# Altium schematic sheet fan.SchDoc
size A4
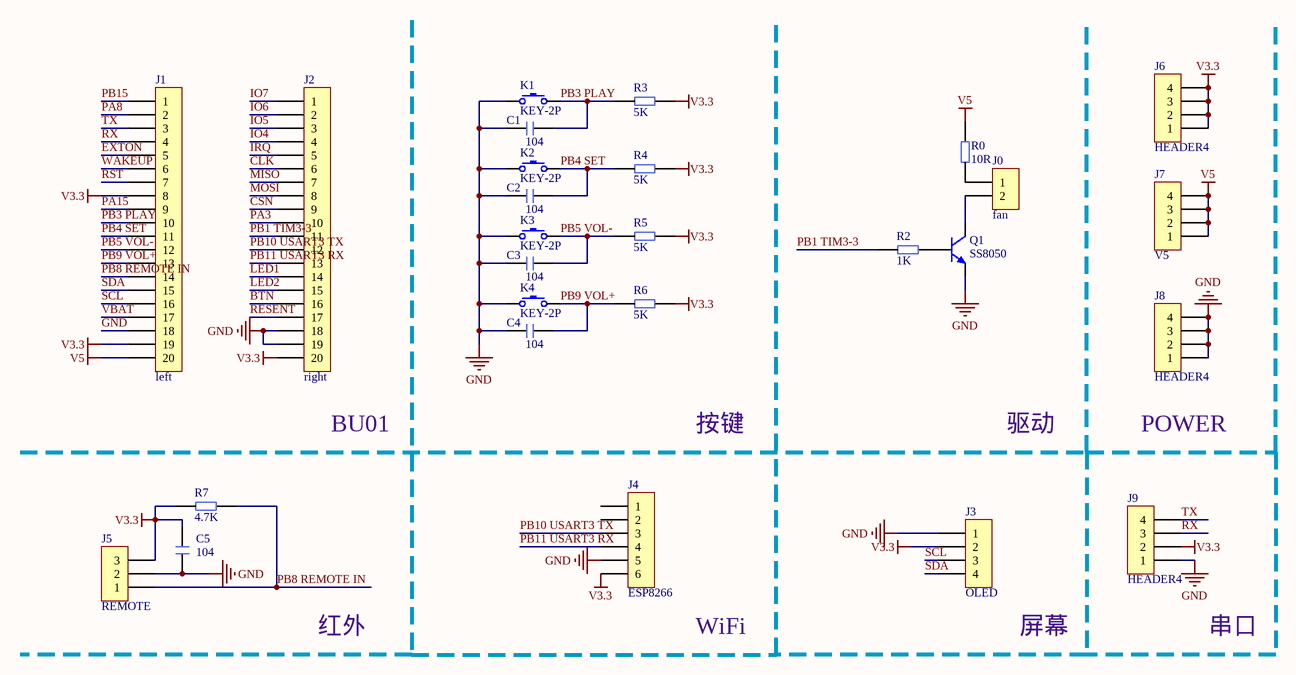
[diagram p0: fan.SchDoc]

## Parts
C1  104  [C-RAD254]
C2  104  [C-RAD254]
C3  104  [C-RAD254]
C4  104  [C-RAD254]
C5  104  [C-RAD254]
J0  fan  [PIN-2-2.54-1.0]
J1  left  [PIN-20-2.54-1.0]
J2  right  [PIN-20-2.54-1.0]
J3  OLED  [PIN-4-2.54-1.0]
J4  ESP8266  [SIP6]
J5  REMOTE  [SIP3]
J6  HEADER4  [SIP4]
J7  V5  [SIP4]
J8  HEADER4  [SIP4]
J9  HEADER4  [SIP4]
K1  KEY-2P  [KEY_M]
K2  KEY-2P  [KEY_M]
K3  KEY-2P  [KEY_M]
K4  KEY-2P  [KEY_M]
Q1  SS8050  [TO-92]
R0  10R  [R-AXIAL-0.4]
R2  1K  [R-AXIAL-0.4]
R3  5K  [R-AXIAL-0.4]
R4  5K  [R-AXIAL-0.4]
R5  5K  [R-AXIAL-0.4]
R6  5K  [R-AXIAL-0.4]
R7  4.7K  [R-AXIAL-0.4]

## Nets
GND: C1.1 C2.1 C3.1 C4.1 C5.1 J1.18 J2.18 J2.19 J3.1 J4.5 J5.2 J8.1 J8.2 J8.3 J8.4 J9.1 K1.1 K2.1 K3.1 K4.1 Q1.2(E)
V3.3: C5.2 J1.8 J1.19 J2.20 J3.2 J4.6 J5.3 J6.1 J6.2 J6.3 J6.4 J9.2 R3.1 R4.1 R5.1 R6.1 R7.2
V5: J1.20 J7.1 J7.2 J7.3 J7.4 R0.1
BTN: J2.16
CLK: J2.6
CSN: J2.9
EXTON: J1.5
IO4: J2.4
IO5: J2.3
IO6: J2.2
IO7: J2.1
IRQ: J2.5
LED1: J2.14
LED2: J2.15
MISO: J2.7
MOSI: J2.8
PA3: J2.10
PA8: J1.2
PA15: J1.9
PB1 TIM3-3: J2.11 R2.2
PB3 PLAY: C1.2 J1.10 K1.2 R3.2
PB4 SET: C2.2 J1.11 K2.2 R4.2
PB5 VOL-: C3.2 J1.12 K3.2 R5.2
PB8 REMOTE IN: J1.14 J5.1 R7.1
PB9 VOL+: C4.2 J1.13 K4.2 R6.2
PB10 USART3 TX: J2.12 J4.3
PB11 USART3 RX: J2.13 J4.4
PB15: J1.1
RESENT: J2.17
RST: J1.7
RX: J1.4 J9.3
SCL: J1.16 J3.3
SDA: J1.15 J3.4
TX: J1.3 J9.4
VBAT: J1.17
WAKEUP: J1.6
NetJ0_1: J0.1 R0.2
NetJ0_2: J0.2 Q1.3(C)
NetQ1_1: Q1.1(B) R2.1

Not connected (* = marked no-connect by the designer): J4 1 2

## Notes on the sheet
- BU01
- 按键
- 驱动
- POWER
- 红外
- WiFi
- 屏幕
- 串口

## Library data of the parts
C1-C5 = CAP
J0 = HDR1x2: Connector
J1 J2 = HDR1x20: Connector
J3 = HDR1x4: Connector
J4 = HEADER6
J5 = HEADER3
J7 = HEADER4
K1-K4 = KEY-2P: Key
Q1 = 8050-SMD: 高频放大-NPN型; 版权归属: 源创客; 属性: 40V 1.5A 1W 100MHZ; BOM名称: 高频放大-NPN型; 学习资源: www.ooocke.com
R0 R2-R7 = RES